# EasyEDA Pro project ProPrj_小中心板_2025-08-09.epro, schematic Schematic1
Board Name: 小中心板; Create Date: 2025-01-12; Page Name: P1; Project Name: 小中心板; Schematic Name: Schematic1; Update Date: 2025-01-12; Company: 嘉立创EDA; Page Size: A4; Version: V1.0
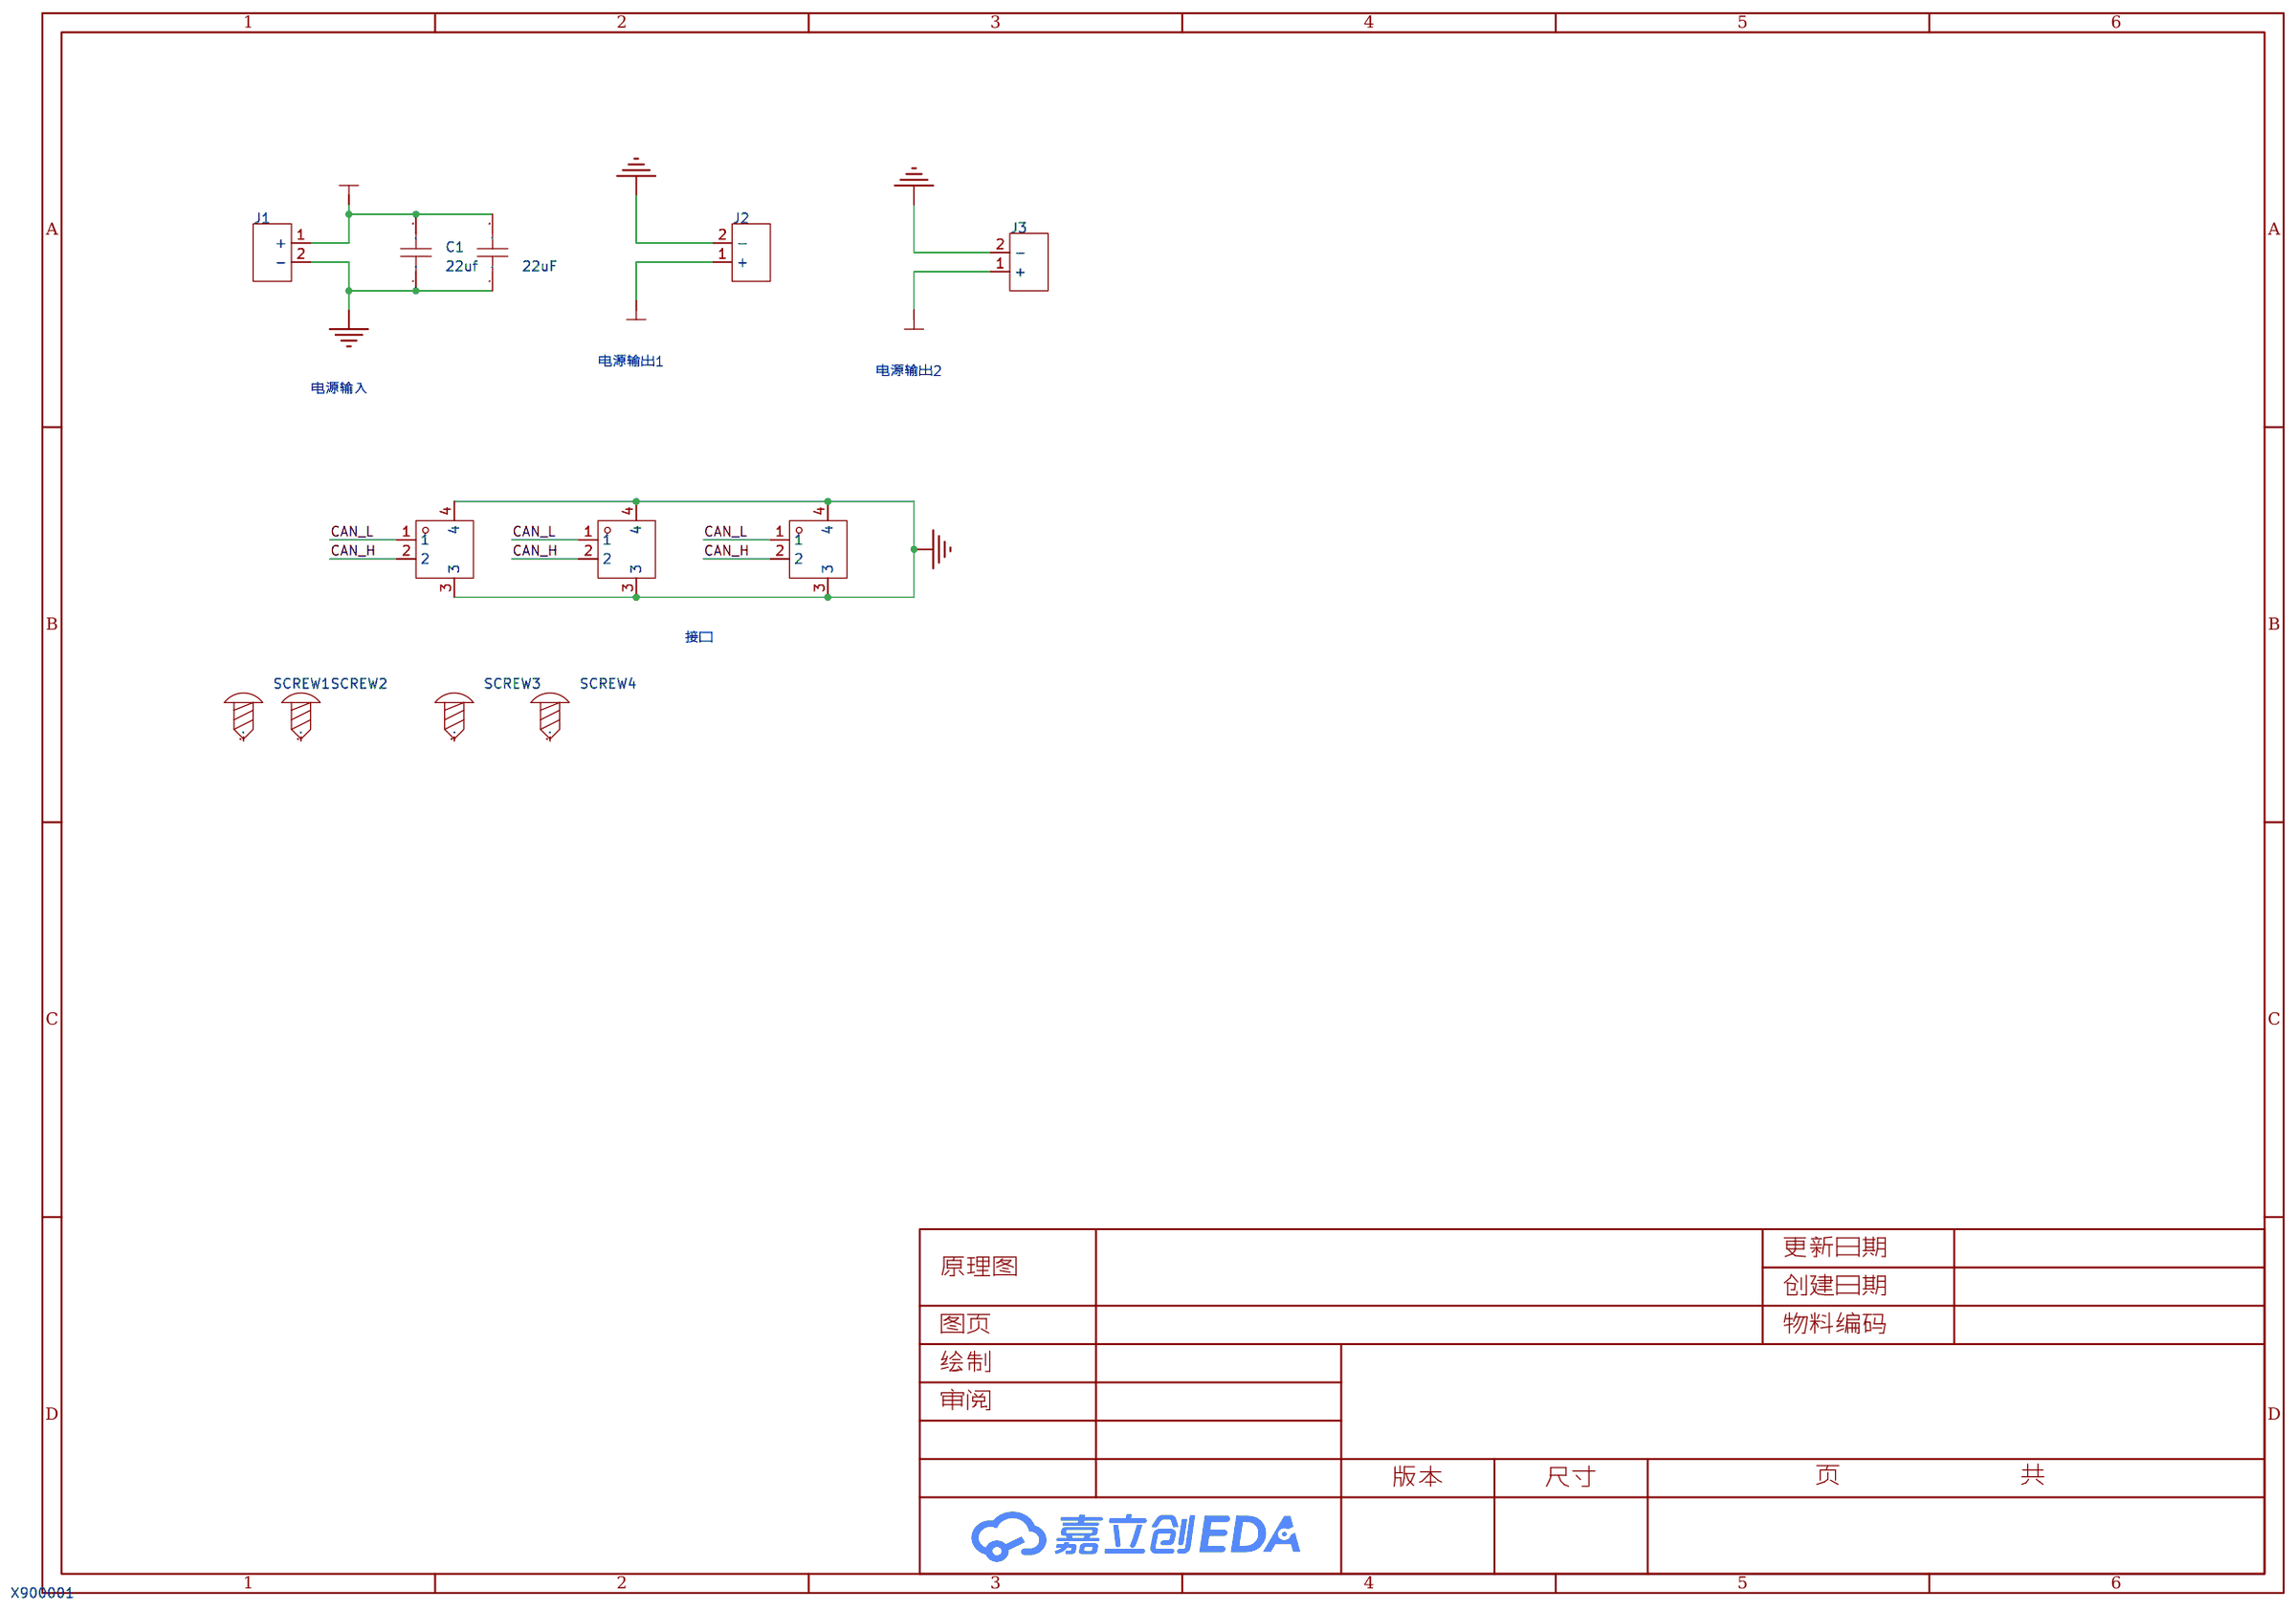
[diagram p5: schematic sheet]

## Parts
C1  22uf  [C0603]
C4  22uF  [C0603]
CN15  WAFER-GH1.25-2PLB  [CONN-TH_2P-P1.25_XUNPU_WAFER-GH1.25-2PLB]
CN16  WAFER-GH1.25-2PLB  [CONN-TH_2P-P1.25_XUNPU_WAFER-GH1.25-2PLB]
CN17  WAFER-GH1.25-2PLB  [CONN-TH_2P-P1.25_XUNPU_WAFER-GH1.25-2PLB]
J1  XT30UPB-F30.G.Y  [CONN-TH_XT30UPB-F]
J2  XT30UPB-F30.G.Y  [CONN-TH_XT30UPB-F]
J3  XT30UPB-F30.G.Y  [CONN-TH_XT30UPB-F]
SCREW1  -  [M2螺丝]
SCREW2  -  [M2螺丝]
SCREW3  -  [M3螺丝]
SCREW4  -  [M3螺丝]

## Library data of the parts
C1 C4 = CAP_0603: Supplier Footprint: 0603
CN15-CN17 = WAFER-GH1.25-2PLB: 插针结构:1x2P;间距:1.25mm;安装方式:立贴;参考系列:GH;总PIN数:2P;排数:1;每排PIN数:2;额定电流:1A;工作温度范围:-25℃~+85℃;; LCSC Part Name: 1x2P 间距:1.25mm 立贴 系列:GH; Supplier Part: C3029368; Manufacturer: XUNPU(讯普); Supplier Footprint: SMD,P=1.25mm; JLCPCB Part Class: 扩展库; Datasheet: https://atta.szlcsc.com/upload/public/pdf/source/20220527/44F824AAC8C2B617205E15955FF9C23D.pdf; Supplier: LCSC; Pins Structure: 1x2P; Pitch: 1.25mm; Mounting Style: 立贴; Reference Series: GH; Number of Pins: 2P; Number of Rows: 1; Number of PINs Per Row: 2; Current Rating (Max): 1A; Operating Temperature Range: -25℃~+85℃
J1-J3 = XT30UPB-F30.G.Y: 类别:-;类型1:-;; LCSC Part Name: AMASS(艾迈斯)直立焊板式连接器XT30UPB30-F.G.*; Supplier Part: C108769; Manufacturer: AMASS(艾迈斯); JLCPCB Part Class: 扩展库; Datasheet: https://atta.szlcsc.com/upload/public/pdf/source/20220715/AFD68B9E8B6CA95A7295DBF4AF9325E4.pdf; Supplier: LCSC; Brand: 艾迈斯; Type: 航模插头; Colour: 黄色; RatedVoltage: DC 500V; InterfaceType: 母头; MetalMaterial: 镀金; InsulationMaterial: PA; RatedCurrent: 15A; contact resistance: 0.65mΩ
SCREW1 SCREW2 = M2螺丝: Supplier Footprint: 插件
SCREW3 SCREW4 = M3螺丝: Supplier Footprint: 插件

## Nets
GND: C1.1 C4.1 CN15.3 CN15.4 CN16.3 CN16.4 CN17.3 CN17.4 J1.2(-) J2.2(-) J3.2(-)
VCC_BAT: C1.2 C4.2 J1.1(+) J2.1(+) J3.1(+)
CAN_H: CN15.2 CN16.2 CN17.2
CAN_L: CN15.1 CN16.1 CN17.1

Not connected (* = marked no-connect by the designer): SCREW1 1; SCREW2 1; SCREW3 1; SCREW4 1

## Notes on the sheet
- 电源输出1
- 电源输出2
- 电源输入
- 接口
